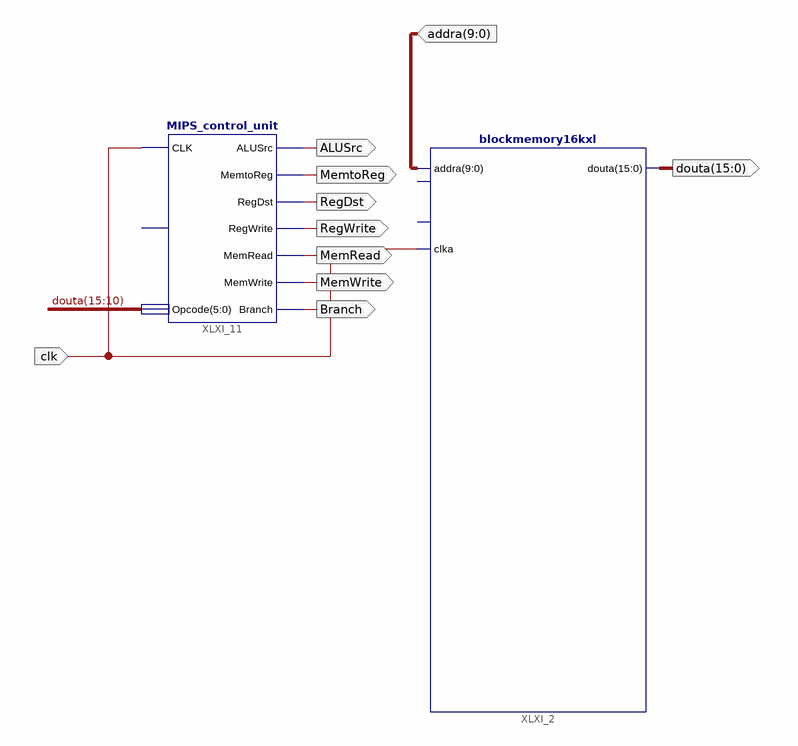
[diagram p0: schematic sheet 1]
// Xilinx ISE schematic component_schematic.sch (spartan3e) as structural Verilog: 2 symbols, 10 ports
module component_schematic (
  input  clk,
  input  [9:0] addra,
  output ALUSrc,
  output MemtoReg,
  output RegDst,
  output RegWrite,
  output MemRead,
  output MemWrite,
  output Branch,
  output [15:0] douta
);

  blockmemory16kxl XLXI_2 (.addra(addra), .clka(clk), .douta(douta));  // open: dina, wea
  MIPS_control_unit XLXI_11 (
    .CLK(clk), .Opcode(douta[15:10]), .ALUSrc(ALUSrc), .MemtoReg(MemtoReg), .RegDst(RegDst),
    .RegWrite(RegWrite), .MemRead(MemRead), .MemWrite(MemWrite), .Branch(Branch));  // open: Reset
endmodule
